# EAGLE design helmet_blinker_light_v0.2 (EAGLE 7.6.0)
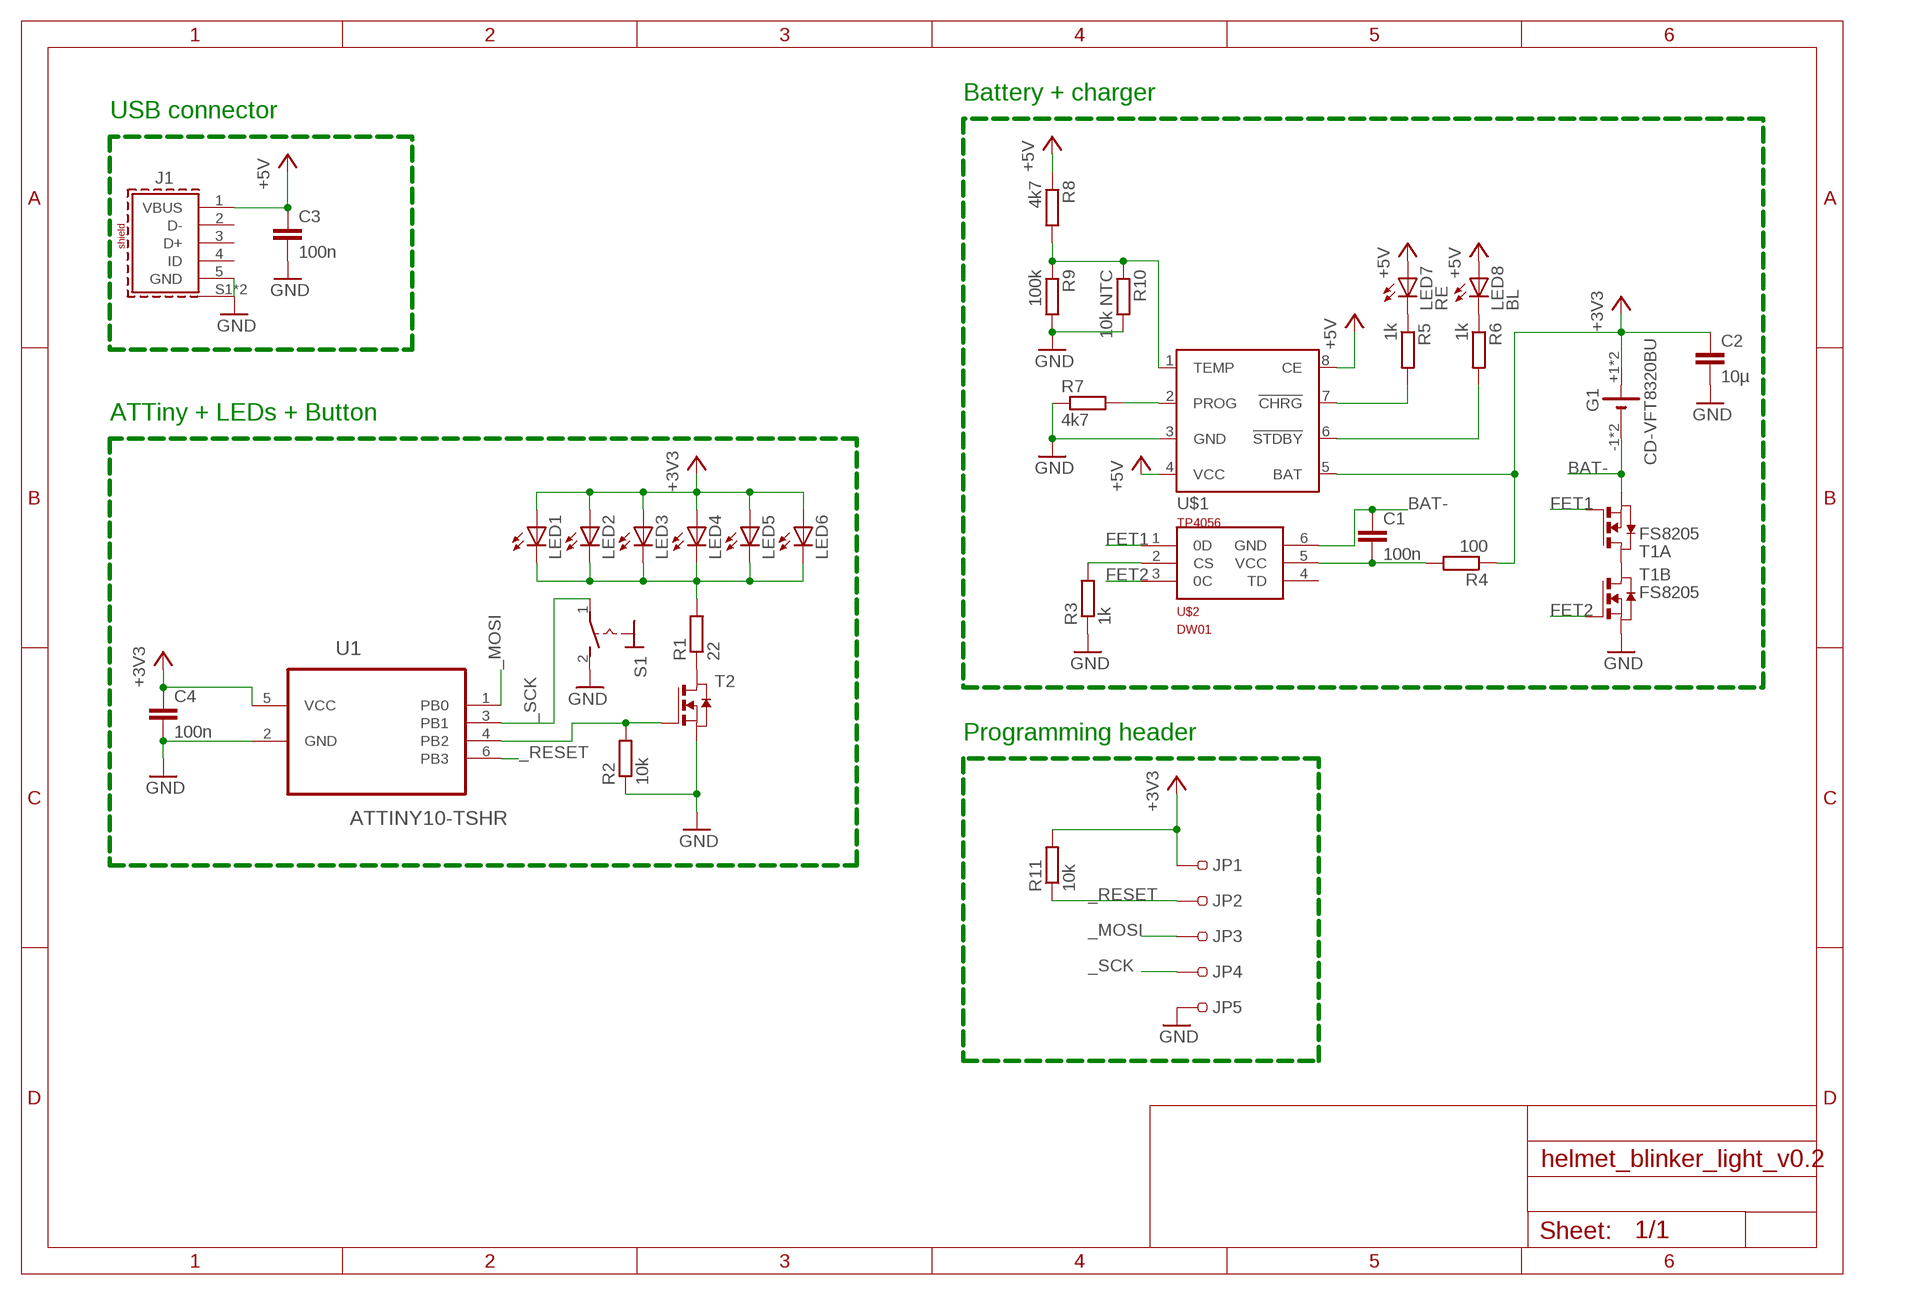
[diagram p0: schematic, sheet 1]

## Parts
C1  100n  C-EUC0402K  [C0402K]
C2  10µ  C-EUC0805K  [C0805K]
C3  100n  C-EUC0402K  [C0402K]
C4  100n  C-EUC0402K  [C0402K]
G1  CD-VFT8320BU  [CS-VFT8320BU]
J1  614105150621  [614105150621]
JP1  0.7MM_POGO-PINS  [0.7MM_POGO-PINS]
JP2  0.7MM_POGO-PINS  [0.7MM_POGO-PINS]
JP3  0.7MM_POGO-PINS  [0.7MM_POGO-PINS]
JP4  0.7MM_POGO-PINS  [0.7MM_POGO-PINS]
JP5  0.7MM_POGO-PINS  [0.7MM_POGO-PINS]
LED1  LEDCHIPLED_0805  [CHIPLED_0805]
LED2  LEDCHIPLED_0805  [CHIPLED_0805]
LED3  LEDCHIPLED_0805  [CHIPLED_0805]
LED4  LEDCHIPLED_0805  [CHIPLED_0805]
LED5  LEDCHIPLED_0805  [CHIPLED_0805]
LED6  LEDCHIPLED_0805  [CHIPLED_0805]
LED7  RE  LEDCHIPLED_0805  [CHIPLED_0805]
LED8  BL  LEDCHIPLED_0805  [CHIPLED_0805]
R1  22  R-EU_R0805  [R0805]
R2  10k  R-EU_R0402  [R0402]
R3  1k  R-EU_R0402  [R0402]
R4  100  R-EU_R0402  [R0402]
R5  1k  R-EU_R0402  [R0402]
R6  1k  R-EU_R0402  [R0402]
R7  4k7  R-EU_R0402  [R0402]
R8  4k7  R-EU_R0402  [R0402]
R9  100k  R-EU_R0402  [R0402]
R10  10k NTC  R-EU_R0805  [R0805]
R11  10k  R-EU_R0402  [R0402]
S1  TS-1088  [TS-1088]
T1  FS8205  DMN3024LSD  [TSSOP-8]
T2  NMOSSOT23  [SOT-23]
U1  ATTINY10-TSHR  [SOT95P280X145-6N]
U$1  TP4056  [SOT23-8]
U$2  DW01  [SOT23-6]

## Nets
+3V3: C2.1 C4.1 G1.+1(+) G1.+2(+) JP1.1 LED1.A LED2.A LED3.A LED4.A LED5.A LED6.A R4.1 R11.2 U1.5(VCC) U$1.5(BAT)
+5V: C3.1 J1.1(VBUS) LED7.A LED8.A R8.1 U$1.4(VCC) U$1.8(CE)
_MOSI: JP3.1 U1.1(PB0)
_RESET: JP2.1 R11.1 U1.6(PB3)
_SCK: JP4.1 S1.1(P) U1.3(PB1)
BAT-: C1.1 G1.-1(-) G1.-2(-) T1.2(A:S) T1.3(A:S) U$2.6(GND)
FET1: T1.4(A:G) U$2.1(0D)
FET2: T1.5(B:G) U$2.3(0C)
GND: C2.2 C3.2 C4.2 J1.5(GND) J1.S1(SHIELD) J1.S2(SHIELD) JP5.1 R2.1 R3.1 R7.1 R9.2 R10.2 S1.2(S) T1.6(B:S) T1.7(B:S) T2.2(S) U1.2(GND) U$1.3(GND)
N$1: T1.1(A:D) T1.8(B:D)
N$2: R1.1 T2.1(D)
N$3: R3.2 U$2.2(CS)
N$4: R2.2 T2.3(G) U1.4(PB2)
N$5: LED1.C LED2.C LED3.C LED4.C LED5.C LED6.C R1.2
N$6: C1.2 R4.2 U$2.5(VCC)
N$8: R7.2 U$1.2(PROG)
N$9: R6.2 U$1.6(!STDBY)
N$10: LED7.C R5.1
N$11: LED8.C R6.1
N$12: R5.2 U$1.7(!CHRG)
N$13: R8.2 R9.1 R10.1 U$1.1(TEMP)
Unconnected: J1.2(D-) J1.3(D+) J1.4(ID) U$2.4(TD)

## Notes on the sheet
- Battery + charger
- USB connector
- ATTiny + LEDs + Button
- Programming header

## Library data of the parts
C1-C4 = rcl:C-EU: CAPACITOR, European symbol
G1 = battery:CD-VFT8320BU: LI BATTERY Sonnenschein
J1 = 632723300011_Eagle_WR-USB_rev20a:614105150621: WR-COM Micro USB 2.0 Type AB Vertical 5 Contacts Kind Properties Durability:10 000 Mating cycles Quality Class:10 000 Mating cycles Connector Type:Micro USB Gender:Receptacle Type:Vertical General Information Operating Temperature:-40up to +105 °C Compliance:RoHS Electrical Properties IR 1:1.8A Working Voltage:30V (AC) Withstanding Voltage:100V (AC) Contact Resistance:30 mΩ Material Properties Insulator Material:LCP Insulator Flammability Rating:UL94 V-0 Color:Black Contact Material:Copper Alloy Contact Plating: Gold Contact Type:Stamped Shielding Material:Stainless Steel Shielding Plating:Matte Tin <https://www.we-online.com/catalog/media/o33043v209%20Family_WR-COM_Micro-USB_Type-AB_614105150621.jpg> Details see: https://www.we-online.com/catalog/en/COM_MICRO_TYPE_AB_VERTICAL/ Updated by Yingchun, Shan 2020-01-16 2020 (C) Würth Elektronik; APPLICATION: Micro USB 2.0; DATASHEET-URL: https://www.we-online.com/catalog/datasheet/614105150621.pdf; GERDER: Receptacle; INTERFACE-TYPE: TypeAB; IR1: 1.8A; MOUNT: THT; PACKAGING: Tape and Reel; PART-NUMBER: 614105150621; PINS: 5; TYPE: Vertical; WORKING-VOLTAGE: 30V(AC)
JP1-JP5 = pinhead:0.7MM_POGO-PINS: PIN HEADER
LED1-LED8 = led:LED: LED OSRAM: - CHIPLED LG R971, LG N971, LY N971, LG Q971, LY Q971, LO R971, LY R971 LH N974, LH R974 LS Q976, LO Q976, LY Q976 LO Q996 - Hyper CHIPLED LW Q18S LB Q993, LB Q99A, LB R99A - SideLED LS A670, LO A670, LY A670, LG A670, LP A670 LB A673, LV A673, LT A673, LW A673 LH A674 LY A675 LS A676, LA A676, LO A676, LY A676, LW A676 LS A679, LY A679, LG A679 - Hyper Micro SIDELED® LS Y876, LA Y876, LO Y876, LY Y876 LT Y87S - SmartLED LW L88C, LW L88S LB L89C, LB L89S, LG L890 LS L89K, LO L89K, LY L89K LS L896, LA L896, LO L896, LY L896 - TOPLED LS T670, LO T670, LY T670, LG T670, LP T670 LSG T670, LSP T670, LSY T670, LOP T670, LYG T670 LG T671, LOG T671, LSG T671 LB T673, LV T673, LT T673, LW T673 LH T674 LS T676, LA T676, LO T676, LY T676, LB T676, LH T676, LSB T676, LW T676 LB T67C, LV T67C, LT T67C, LS T67K, LO T67K, LY T67K, LW E67C LS E67B, LA E67B, LO E67B, LY E67B, LB E67C, LV E67C, LT E67C LW T67C LS T679, LY T679, LG T679 LS T770, LO T770, LY T770, LG T770, LP T770 LB T773, LV T773, LT T773, LW T773 LH T774 LS E675, LA E675, LY E675, LS T675 LS T776, LA T776, LO T776, LY T776, LB T776 LHGB T686 LT T68C, LB T68C - Hyper Mini TOPLED® LB M676 - Mini TOPLED Santana® LG M470 LS M47K, LO M47K, LY M47K Source: http://www.osram.convergy.de LUXEON: - LUMILED® LXK2-PW12-R00, LXK2-PW12-S00, LXK2-PW14-U00, LXK2-PW14-V00 LXK2-PM12-R00, LXK2-PM12-S00, LXK2-PM14-U00 LXK2-PE12-Q00, LXK2-PE12-R00, LXK2-PE12-S00, LXK2-PE14-T00, LXK2-PE14-U00 LXK2-PB12-K00, LXK2-PB12-L00, LXK2-PB12-M00, LXK2-PB14-N00, LXK2-PB14-P00, LXK2-PB14-Q00 LXK2-PR12-L00, LXK2-PR12-M00, LXK2-PR14-Q00, LXK2-PR14-R00 LXK2-PD12-Q00, LXK2-PD12-R00, LXK2-PD12-S00 LXK2-PH12-R00, LXK2-PH12-S00 LXK2-PL12-P00, LXK2-PL12-Q00, LXK2-PL12-R00 Source: www.luxeon.com KINGBRIGHT: KA-3528ASYC Source: www.kingbright.com
R1-R11 = rcl:R-EU_: RESISTOR, European symbol
S1 = switch:TS-1088: TOGGLE SWITCH Button TS-1088 https://lcsc.com/product-detail/Tactile-Switches_XUNPU-TS-1088-AR02016_C720477.html/?href=jlc-SMT https://lcsc.com/product-detail/Tactile-Switches_Korean-Hroparts-Elec-K2-1807SA-B4DW-06_C223822.html LCSC (JLCPCB): C720477 LCSC (JLCPCB): C223822
T1 = FS8205A:DMN3024LSD: DUAL N-CHANNEL ENHANCEMENT MODE MOSFET data sheet <http://goo.gl/dRgboR> Dave.Calaway Eagle Library <https://goo.gl/Muy1Tr>
T2 = zetex:NMOSSOT23: MOS FET; OC_FARNELL: unknown; OC_NEWARK: unknown
U1 = Atmel_By_element14_Batch_1-00:ATTINY10-TSHR: 8-bit Microcontroller with In-System Programmable Flash; MPN: ATTINY10-TSHR; OC_FARNELL: 1748538; OC_NEWARK: 26R5645; PACKAGE: SOT-23-6; SUPPLIER: Atmel
U$1 = TP4056:TP4056: TP4056 Data sheet <http://goo.gl/J7k8TF> Dave.Calaway Eagle Library <https://goo.gl/Muy1Tr>
U$2 = DW01:DW01: The DW01-P battery protection IC is designed to protect lithium-ion/polymer battery from damage or degrading the lifetime due to overcharge, overdischarge, and/or overcurrent for one-cell lithium-ion/polymer battery powered systems, such as cellular phones. Data sheet <http://goo.gl/4y108d> Dave.Calaway Eagle Library <https://goo.gl/Muy1Tr>

## Board
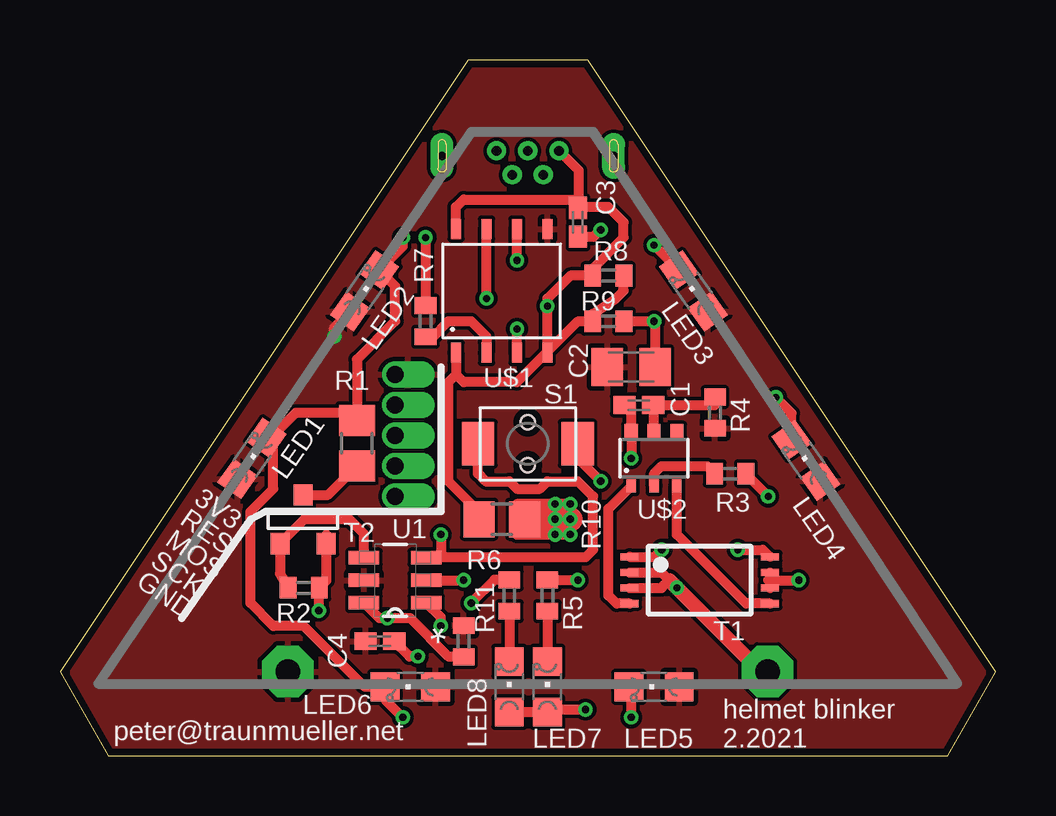
[diagram p1: board, top side]
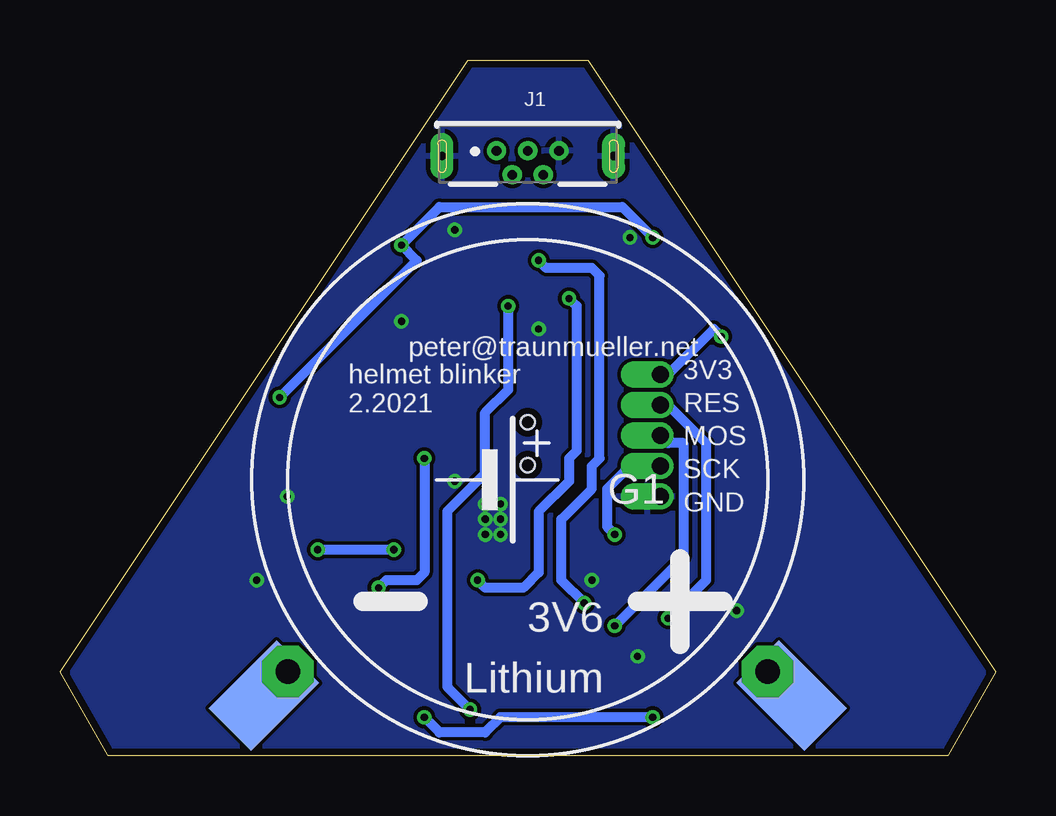
[diagram p2: board, bottom side, seen from below]

Size 39 x 29 mm. Coordinates in mm from the lower left corner, seen from the top.
Outline: 0,3.5 2,0 37,0 39,3.5 22,29 17,29 0,3.5
Copper layers (1*16): Top 0.035mm / dielectric 1.5mm / Bottom 0.035mm
Design rules "PCB-POOL Standard": minimum track width 0.15mm, minimum drill 0.3mm, track to track 0.15mm, track to pad 0.15mm, pad to pad 0.15mm, via to via 0.15mm, smd to smd 0.15mm, copper to edge 0.3mm, drill to drill 0.2mm, minimum pad ring 0.2mm, minimum via ring 0.15mm, stop-mask expansion 0.075mm, vias tented up to drill 0mil, thermal gap 0.2mm

### Footprints (pad centres in the part's own frame; a part is rotated, then mirrored left to right if it is on the bottom)
C0402K = smd 0.925 x 0.74: 1 -0.6,0; 2 0.6,0
C0805K = smd 1.3 x 1.6: 1 -1,0; 2 1,0
CS-VFT8320BU = drill 1.016 pad 2.159 octagon: +1 -10,8; -1 10,8 | smd 4 x 2.5 rotated 315: +2 -11,9 | smd 4 x 2.5 rotated 45: -2 11,9
614105150621 = drill 0.4: 1 -1.3,0.125; 2 -0.65,-0.875; 3 0,0.125; 4 0.65,-0.875; 5 1.3,0.125 | drill 0.35 pad 0.95 long: S1 -3.575,-0.095; S2 3.575,-0.095
0.7MM_POGO-PINS = drill 0.7 pad 0.85 offset: 1 0,0
CHIPLED_0805 = smd 1.2 x 1.2: A 0,-1.05; C 0,1.05
R0805 = smd 1.3 x 1.5: 1 -0.95,0; 2 0.95,0
R0402 = smd 0.7 x 0.9: 1 -0.65,0; 2 0.65,0
TS-1088 = smd 1.35 x 1.8: 1 -2.075,0; 2 2.075,0 | hole 0.6: 0,0.9; 0,-0.9
TSSOP-8 = smd 0.3 x 0.75: 1 -0.975,-2.925; 2 -0.325,-2.925; 3 0.325,-2.925; 4 0.975,-2.925; 5 0.975,2.925; 6 0.325,2.925; 7 -0.325,2.925; 8 -0.975,2.925
SOT-23 = smd 0.787 x 0.889: 1 0.025,-1.016; 2 -0.94,1.016; 3 0.991,1.016
SOT95P280X145-6N = smd 1.27 x 0.559: 1 -1.295,0.94; 2 -1.295,0; 3 -1.295,-0.94; 4 1.295,-0.94; 5 1.295,0; 6 1.295,0.94
SOT23-8 = smd 0.42 x 0.835: 1 -1.905,-2.58; 2 -0.635,-2.58; 3 0.635,-2.58; 4 1.905,-2.58; 5 1.905,2.58; 6 0.635,2.58; 7 -0.635,2.58; 8 -1.905,2.58
SOT23-6 = smd 0.4 x 0.55: 1 -0.95,-1.15; 2 0,-1.15; 3 0.95,-1.15 | smd 0.55 x 0.55: 4 0.95,1.15; 5 0,1.15; 6 -0.95,1.15

### Placement (x,y rotation side)
C1  24.13,14.61 0 top
C2  23.81,16.2 0 top
C3  21.59,22.23 270 top
C4  13.34,4.77 0 top
G1  19.5,11.5 180 bottom
J1  19.5,25.09 0 bottom
JP1  13.97,15.88 0 top
JP2  13.97,14.61 0 top
JP3  13.97,13.34 0 top
JP4  13.97,12.07 0 top
JP5  13.97,10.8 0 top
LED1  8,12.39 325 top
LED2  12.7,19.38 325 top
LED3  26.4,19.38 35 top
LED4  31.1,12.3 35 top
LED5  24.77,2.87 90 top
LED6  14.61,2.87 90 top
LED7  20.32,2.87 0 top
LED8  18.73,2.87 0 top
R1  12.38,13.03 90 top
R2  10.16,6.99 180 top
R3  27.94,11.76 180 top
R4  27.3,14.29 90 top
R5  20.32,6.67 90 top
R6  18.73,6.67 90 top
R7  15.24,18.11 270 top
R8  22.86,20.01 0 top
R9  22.86,18.11 0 top
R10  18.41,9.85 0 top
R11  16.83,4.77 90 top
S1  19.5,13 0 top
T1  26.67,7.31 270 top
T2  10.16,9.85 180 top
U1  13.97,7.31 180 top
U$1  18.41,19.38 0 top
U$2  24.77,12.39 0 top

### Tracks (layer width: path | path; a pad name or v marks a point on that pad's centre or on a via)
+3V3  (via drill 0.3)
  Top 0.406: v11.43,17.47 11.43,17.85 LED2.A
  Bottom 0.406: G1.+2 G1.+1 | JP1.1 13.65,15.88 11.75,17.79 v11.43,17.47
  pour Top: 16.51,30.17 -10.16,3.5 -5.08,-1.58 38.1,-1.58 43.81,4.13 43.81,11.12 24.13,30.8
+5V  (via drill 0.3)
  Top 0.406: U$1.8 16.51,22.87 16.83,23.18 21.62,23.18 | 21.62,23.18 C3.1 21.62,22.87 22.86,22.87 23.5,22.23 23.5,21.6 22.21,20.31 R8.1 21.27,20.01 20.32,19.06 v20.32,18.74 U$1.4 | LED8.A LED7.A 20.42,1.91 v21.91,1.91 | 21.62,23.18 21.62,24.39 J1.1
  Bottom 0.406: v20.32,18.74 20.32,15.25 21.27,14.29 21.27,11.76 22.86,10.17 22.86,2.87 v21.91,1.91
_MOSI  (via drill 0.3)
  Top 0.406: v15.88,5.41 15.88,5.76 U1.1
  Bottom 0.406: v15.88,5.41 13.02,8.26 13.02,13.03 13.65,13.03 JP3.1
_RESET  (via drill 0.3)
  Top 0.406: U1.6 13.32,5.72 v13.65,5.72 14.61,5.72 16.21,4.12 R11.1
  Bottom 0.406: JP2.1 13.65,14.61 12.06,13.03 12.06,7.31 v13.65,5.72
_SCK  (via drill 0.3)
  Top 0.406: 15.88,8.26 21.91,8.26 22.23,8.58 22.23,10.8 21.59,11.44 20.32,11.44 20,11.12 19.05,11.12 18.73,11.44 17.74,11.44 17.43,11.76 S1.1 | 15.88,8.26 15.28,8.26 U1.3 | v15.88,9.21 15.88,8.26
  Bottom 0.406: JP4.1 15.24,12.07 16.19,11.12 16.19,9.53 v15.88,9.21
BAT-  (via drill 0.3)
  Top 0.406: T1.2 25.07,7.63 25.4,7.31 25.07,6.98 T1.3 | C1.1 23.82,14.64 U$2.6 v23.82,12.39 v23.81,12.39
  Top 0.61: G1.-1 29.21,3.5 v25.72,6.99 25.4,7.31
  Bottom 0.406: G1.-2 G1.-1 | v23.81,12.39 23.81,7.63 24.13,7.31 25.4,7.31 v25.72,6.99
FET1
  Top 0.406: T1.4 23.2,6.33 22.86,6.67 22.86,10.29 U$2.1
FET2
  Top 0.406: T1.5 28.6,6.33 25.72,9.21 U$2.3
GND  (via drill 0.3)
  Top 0.406: U$1.3 v19.05,17.79 | R9.2 v24.77,18.11 24.81,18.06 C2.2 | 11.1,9.2 T2.2 11.1,7.28 R2.1 10.79,6.69 v10.79,6.04 | U1.2 v16.83,7.31 | T1.6 T1.7 29.59,7.38 29.53,7.31 v30.8,7.31 | R3.1 28.59,11.74 v29.53,10.8 | S1.2 21.57,12.4 v22.54,11.44 | R10.2 19.68,9.85 v20.64,9.85 21.27,9.53 v21.27,9.21 | v15.24,21.6 R7.1 | v21.27,10.48 v21.27,9.85 v21.27,9.21 | v21.27,10.48 v20.64,10.48 | v21.27,10.48 19.05,10.48 19.05,9.21 v21.27,9.21 | v14.92,4.13 14.57,4.13 C4.2 | C3.2 22.26,21.63 v22.54,21.91
  Top 1.016: v21.27,9.85 19.68,9.85
  other vias: 20.64,9.21
  pour Bottom: 15.88,30.8 -10.16,4.77 -10.16,3.5 -5.08,-1.58 38.1,-1.58 43.81,4.13 43.81,11.12 24.13,30.8
N$1  (via drill 0.3)
  Top 0.406: T1.1 24.79,8.29 v25.08,8.58 | v28.26,8.58 29.3,8.58 T1.8
  Bottom 0.406: v25.08,8.58 v28.26,8.58
N$2
  Top 0.406: T2.1 11.17,10.87 R1.1
N$3
  Top 0.406: U$2.2 24.77,11.76 25.08,12.07 26.97,12.07 R3.2
N$4
  Top 0.406: R2.2 9.17,7.57 T2.3 10.19,9.85 12.06,9.85 12.68,9.24 U1.4
N$5  (via drill 0.3)
  Top 0.406: LED2.C 13.74,20.23 | LED3.C v24.77,21.28 | v14.29,21.6 14.29,21.22 LED2.C | LED4.C 30.5,14.28 v29.84,14.93 | v14.29,1.59 13.55,2.33 LED6.C 12.7,2.87 10.16,5.41 8.89,5.41 7.94,6.36 7.94,10.17 8.89,11.12 8.89,12.96 LED1.C 8.8,13.25 9.84,14.29 12.06,14.29 R1.2 12.38,16.52 13.97,18.11 13.97,19.57 LED2.C | v23.81,1.59 23.81,2.77 LED5.C
  Bottom 0.406: v14.29,21.6 15.56,22.87 23.18,22.87 v24.77,21.28 24.13,20.64 v29.84,14.93 | v14.29,1.59 20.64,1.59 21.27,0.96 23.18,0.96 v23.81,1.59
N$6
  Top 0.406: U$2.5 24.77,14.58 C1.2 27.29,14.61 R4.2
N$8
  Top 0.406: U$1.2 17.78,17.47 17.14,18.11 16.19,18.11 15.54,17.45 R7.2
N$9  (via drill 0.3)
  Top 0.406: R6.2 18.11,7.33 v17.14,6.36 | v19.05,20.64 U$1.6
  Bottom 0.406: v17.14,6.36 18.1,7.31 18.1,9.85 16.83,11.12 16.83,12.07 16.51,12.39 16.51,20.01 16.83,20.33 18.73,20.33 v19.05,20.64
N$10
  Top 0.406: R5.1 LED7.C
N$11
  Top 0.406: R6.1 LED8.C
N$12  (via drill 0.3)
  Top 0.406: v21.59,7.31 20.34,7.31 R5.2 | v17.78,19.06 U$1.7
  Bottom 0.406: v17.78,19.06 17.46,18.74 17.46,12.71 17.78,12.39 17.78,11.44 19.05,10.17 19.05,7.63 19.68,6.99 21.27,6.99 v21.59,7.31
N$13
  Top 0.406: R8.2 23.5,20 23.5,19.38 23.18,19.06 22.21,18.41 R9.1 22.23,18.09 21.57,18.09 19.05,15.56 16.83,15.56 16.51,15.88 | R10.1 17.78,9.85 16.19,11.44 16.19,15.56 16.51,15.88 | U$1.1 16.51,15.88

### Text on the board
tPlace: 3V3 / RES / MOS / SCK / GND | peter@traunmueller.net | helmet blinker / 2.2021
bPlace: peter@traunmueller.net | helmet blinker / 2.2021 | 3V3 / RES / MOS / SCK / GND